# EAGLE design csa_ramdisk-v2.0f (EAGLE 4.15)
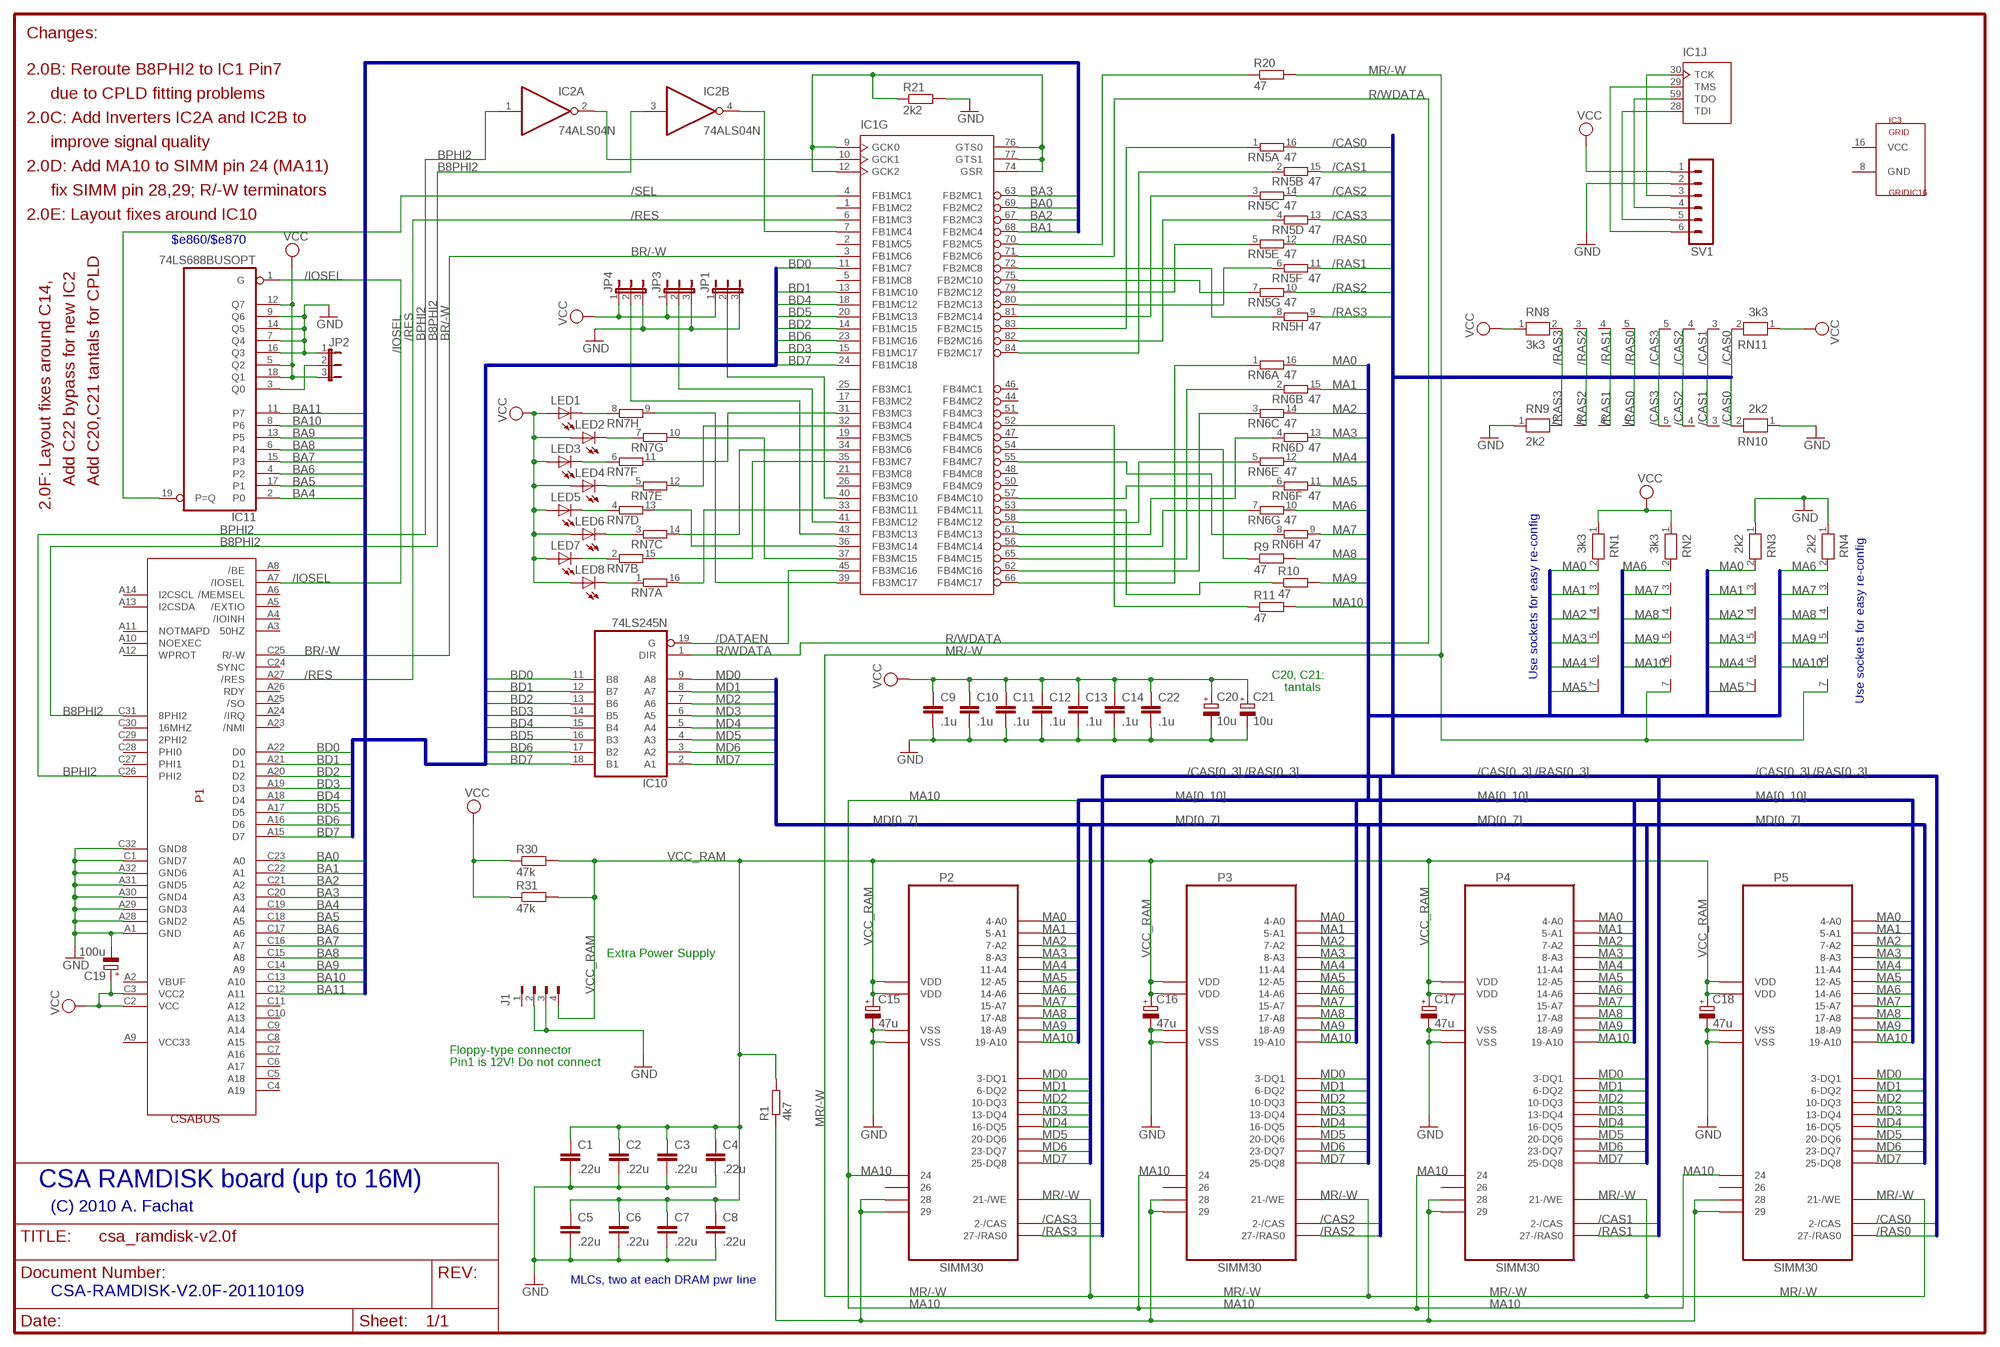
[diagram p0: schematic, sheet 1]

## Parts
C1  .22u  C-EU050-025X075  [C050-025X075]
C2  .22u  C-EU050-025X075  [C050-025X075]
C3  .22u  C-EU050-025X075  [C050-025X075]
C4  .22u  C-EU050-025X075  [C050-025X075]
C5  .22u  C-EU050-025X075  [C050-025X075]
C6  .22u  C-EU050-025X075  [C050-025X075]
C7  .22u  C-EU050-025X075  [C050-025X075]
C8  .22u  C-EU050-025X075  [C050-025X075]
C9  .1u  C-EU050-025X075  [C050-025X075]
C10  .1u  C-EU050-025X075  [C050-025X075]
C11  .1u  C-EU025-025X050  [C025-025X050]
C12  .1u  C-EU050-025X075  [C050-025X075]
C13  .1u  C-EU050-025X075  [C050-025X075]
C14  .1u  C-EU050-025X075  [C050-025X075]
C15  47u  CPOL-EUE2-5  [E2-5]
C16  47u  CPOL-EUE2-5  [E2-5]
C17  47u  CPOL-EUE2-5  [E2-5]
C18  47u  CPOL-EUE2-5  [E2-5]
C19  100u  CPOL-EUE2-5  [E2-5]
C20  10u  CPOL-EUE2.5-7  [E2,5-7]
C21  10u  CPOL-EUE2.5-7  [E2,5-7]
C22  .1u  C-EU050-025X075  [C050-025X075]
IC1  XC9572PC84  [PLCC-S84]
IC2  74ALS04N  [DIL14]
IC3  GRIDIC16  [GRIDIC8]
IC10  74LS245N  [DIL20]
IC11  74LS688BUSOPT  [DIL20]
J1  FLOP-4W827001  [827001]
JP1  JP2E  [JP2]
JP2  JP2E  [JP2]
JP3  JP2E  [JP2]
JP4  JP2E  [JP2]
LED1  LED3MM  [LED3MM]
LED2  LED3MM  [LED3MM]
LED3  LED3MM  [LED3MM]
LED4  LED3MM  [LED3MM]
LED5  LED3MM  [LED3MM]
LED6  LED3MM  [LED3MM]
LED7  LED3MM  [LED3MM]
LED8  LED3MM  [LED3MM]
P1  CSABUS  [CSABUS]
P2  SIMM30  [SIMM30]
P3  SIMM30  [SIMM30]
P4  SIMM30  [SIMM30]
P5  SIMM30  [SIMM30]
R1  4k7  R-EU_0207/10  [0207/10]
R9  47  R-EU_0204/5  [0204/5]
R10  47  R-EU_0204/5  [0204/5]
R11  47  R-EU_0204/5  [0204/5]
R20  47  R-EU_0204/5  [0204/5]
R21  2k2  R-EU_0204/5  [0204/5]
R30  47k  R-EU_0207/10  [0207/10]
R31  47k  R-EU_0207/10  [0207/10]
RN1  3k3  RN06  [RN-7]
RN2  3k3  RN06  [RN-7]
RN3  2k2  RN06  [RN-7]
RN4  2k2  RN06  [RN-7]
RN5  47  8R-N  [DIL16]
RN6  47  8R-N  [DIL16]
RN7  8R-N  [DIL16]
RN8  3k3  RN04  [RN-5]
RN9  2k2  RN04  [RN-5]
RN10  2k2  RN04  [RN-5]
RN11  3k3  RN04  [RN-5]
SV1  MA06-1  [MA06-1]

## Nets
/CAS0: P5.2(2-/CAS) RN5.16 RN10.2 RN11.2
/CAS1: P4.2(2-/CAS) RN5.15 RN10.3 RN11.3
/CAS2: P3.2(2-/CAS) RN5.14 RN10.4 RN11.4
/CAS3: P2.2(2-/CAS) RN5.13 RN10.5 RN11.5
/DATAEN: IC1.45(G:FB3MC16) IC10.19(G)
/IOSEL: IC11.1(G) P1.A7(/IOSEL)
/RAS0: P5.27(27-/RAS0) RN5.12 RN8.5 RN9.5
/RAS1: P4.27(27-/RAS0) RN5.11 RN8.4 RN9.4
/RAS2: P3.27(27-/RAS0) RN5.10 RN8.3 RN9.3
/RAS3: P2.27(27-/RAS0) RN5.9 RN8.2 RN9.2
/RES: IC1.6(G:FB1MC3) P1.A27(/RES)
/SEL: IC1.4(G:FB1MC1) IC11.19(P=Q)
B8PHI2: IC2.3(B:I) P1.C31(8PHI2)
BA0: IC1.69(G:FB2MC2) P1.C23(A0)
BA1: IC1.68(G:FB2MC4) P1.C22(A1)
BA2: IC1.67(G:FB2MC3) P1.C21(A2)
BA3: IC1.63(G:FB2MC1) P1.C20(A3)
BA4: IC11.2(P0) P1.C19(A4)
BA5: IC11.17(P1) P1.C18(A5)
BA6: IC11.4(P2) P1.C17(A6)
BA7: IC11.15(P3) P1.C16(A7)
BA8: IC11.6(P4) P1.C15(A8)
BA9: IC11.13(P5) P1.C14(A9)
BA10: IC11.8(P6) P1.C13(A10)
BA11: IC11.11(P7) P1.C12(A11)
BD0: IC1.11(G:FB1MC7) IC10.11(B8) P1.A22(D0)
BD1: IC1.13(G:FB1MC10) IC10.12(B7) P1.A21(D1)
BD2: IC1.14(G:FB1MC15) IC10.13(B6) P1.A20(D2)
BD3: IC1.15(G:FB1MC17) IC10.14(B5) P1.A19(D3)
BD4: IC1.18(G:FB1MC12) IC10.15(B4) P1.A18(D4)
BD5: IC1.20(G:FB1MC13) IC10.16(B3) P1.A17(D5)
BD6: IC1.23(G:FB1MC16) IC10.17(B2) P1.A16(D6)
BD7: IC1.24(G:FB1MC18) IC10.18(B1) P1.A15(D7)
BPHI2: IC2.1(A:I) P1.C26(PHI2)
BR/-W: IC1.3(G:FB1MC6) P1.C25(R/-W)
GND: C1.2 C2.2 C3.2 C4.2 C5.2 C6.2 C7.2 C8.2 C9.2 C10.2 C11.2 C12.2 C13.2 C14.2 C15.- C16.- C17.- C18.- C19.- C20.- C21.- C22.2 IC11.7(Q4) IC11.9(Q6) IC11.14(Q5) IC11.16(Q3) J1.2 J1.3 JP1.3 JP2.1 JP3.3 JP4.3 P1.A1(GND) P1.A28(GND2) P1.A29(GND3) P1.A30(GND4) P1.A31(GND5) P1.A32(GND6) P1.C1(GND7) P1.C32(GND8) P2.9(VSS) P2.22(VSS) P3.9(VSS) P3.22(VSS) P4.9(VSS) P4.22(VSS) P5.9(VSS) P5.22(VSS) R21.2 RN3.1 RN4.1 RN9.1 RN10.1 SV1.2
MA0: P2.4(4-A0) P3.4(4-A0) P4.4(4-A0) P5.4(4-A0) RN1.2 RN3.2 RN6.16
MA1: P2.5(5-A1) P3.5(5-A1) P4.5(5-A1) P5.5(5-A1) RN1.3 RN3.3 RN6.15
MA2: P2.7(7-A2) P3.7(7-A2) P4.7(7-A2) P5.7(7-A2) RN1.4 RN3.4 RN6.14
MA3: P2.8(8-A3) P3.8(8-A3) P4.8(8-A3) P5.8(8-A3) RN1.5 RN3.5 RN6.13
MA4: P2.11(11-A4) P3.11(11-A4) P4.11(11-A4) P5.11(11-A4) RN1.6 RN3.6 RN6.12
MA5: P2.12(12-A5) P3.12(12-A5) P4.12(12-A5) P5.12(12-A5) RN1.7 RN3.7 RN6.11
MA6: P2.14(14-A6) P3.14(14-A6) P4.14(14-A6) P5.14(14-A6) RN2.2 RN4.2 RN6.10
MA7: P2.15(15-A7) P3.15(15-A7) P4.15(15-A7) P5.15(15-A7) RN2.3 RN4.3 RN6.9
MA8: P2.17(17-A8) P3.17(17-A8) P4.17(17-A8) P5.17(17-A8) R9.2 RN2.4 RN4.4
MA9: P2.18(18-A9) P3.18(18-A9) P4.18(18-A9) P5.18(18-A9) R10.2 RN2.5 RN4.5
MA10: P2.19(19-A10) P2.24 P3.19(19-A10) P3.24 P4.19(19-A10) P4.24 P5.19(19-A10) P5.24 R11.2 RN2.6 RN4.6
MD0: IC10.9(A8) P2.3(3-DQ1) P3.3(3-DQ1) P4.3(3-DQ1) P5.3(3-DQ1)
MD1: IC10.8(A7) P2.6(6-DQ2) P3.6(6-DQ2) P4.6(6-DQ2) P5.6(6-DQ2)
MD2: IC10.7(A6) P2.10(10-DQ3) P3.10(10-DQ3) P4.10(10-DQ3) P5.10(10-DQ3)
MD3: IC10.6(A5) P2.13(13-DQ4) P3.13(13-DQ4) P4.13(13-DQ4) P5.13(13-DQ4)
MD4: IC10.5(A4) P2.16(16-DQ5) P3.16(16-DQ5) P4.16(16-DQ5) P5.16(16-DQ5)
MD5: IC10.4(A3) P2.20(20-DQ6) P3.20(20-DQ6) P4.20(20-DQ6) P5.20(20-DQ6)
MD6: IC10.3(A2) P2.23(23-DQ7) P3.23(23-DQ7) P4.23(23-DQ7) P5.23(23-DQ7)
MD7: IC10.2(A1) P2.25(25-DQ8) P3.25(25-DQ8) P4.25(25-DQ8) P5.25(25-DQ8)
MR/-W: P2.21(21-/WE) P3.21(21-/WE) P4.21(21-/WE) P5.21(21-/WE) R20.2 RN2.7 RN4.7
N$1: IC1.79(G:FB2MC12) RN5.5
N$2: IC1.70(G:FB2MC5) R20.1
N$3: IC1.40(G:FB3MC10) JP1.2
N$4: IC1.41(G:FB3MC12) JP3.2
N$5: IC11.3(Q0) JP2.2
N$6: IC1.55(G:FB4MC7) RN6.8
N$7: IC1.56(G:FB4MC14) RN6.7
N$8: IC1.57(G:FB4MC10) RN6.6
N$9: IC1.58(G:FB4MC12) RN6.5
N$10: IC1.61(G:FB4MC13) RN6.4
N$11: IC1.62(G:FB4MC16) RN6.3
N$12: IC1.65(G:FB4MC15) RN6.2
N$13: IC1.66(G:FB4MC17) RN6.1
N$14: IC1.54(G:FB4MC6) R9.1
N$15: IC1.53(G:FB4MC11) R10.1
N$16: IC1.52(G:FB4MC4) R11.1
N$17: LED1.K(C) RN7.8
N$18: IC1.80(G:FB2MC13) RN5.6
N$19: IC1.75(G:FB2MC10) RN5.7
N$20: IC1.72(G:FB2MC8) RN5.8
N$21: IC1.82(G:FB2MC16) RN5.4
N$22: IC1.81(G:FB2MC14) RN5.3
N$23: IC1.84(G:FB2MC17) RN5.2
N$24: IC1.83(G:FB2MC15) RN5.1
N$25: IC1.43(G:FB3MC13) JP4.2
N$26: IC1.10(G:GCK1) IC2.2(A:O)
N$27: IC1.7(G:FB1MC4) IC2.4(B:O)
N$28: LED2.K(C) RN7.7
N$29: IC1.9(G:GCK0) IC1.12(G:GCK2) IC1.74(G:GSR) IC1.76(G:GTS0) IC1.77(G:GTS1) R21.1
N$30: LED3.K(C) RN7.6
N$31: LED4.K(C) RN7.5
N$32: LED5.K(C) RN7.4
N$33: LED6.K(C) RN7.3
N$34: LED7.K(C) RN7.2
N$35: LED8.K(C) RN7.1
N$36: IC1.37(G:FB3MC15) RN7.10
N$37: P2.28 P2.29 P3.28 P3.29 P4.28 P4.29 P5.28 P5.29 R1.1
N$38: IC1.31(G:FB3MC3) RN7.11
N$39: IC1.32(G:FB3MC4) RN7.12
N$40: IC1.39(G:FB3MC17) RN7.9
N$41: IC1.34(G:FB3MC6) RN7.14
N$42: IC1.35(G:FB3MC7) RN7.15
N$43: IC1.33(G:FB3MC11) RN7.16
N$45: IC1.36(G:FB3MC14) RN7.13
R/WDATA: IC1.71(G:FB2MC6) IC10.1(DIR)
TCK: IC1.30(J:TCK) SV1.3
TDI: IC1.28(J:TDI) SV1.5
TDO: IC1.59(J:TDO) SV1.4
TMS: IC1.29(J:TMS) SV1.6
VCC: C9.1 C10.1 C11.1 C12.1 C13.1 C14.1 C19.+ C20.+ C21.+ C22.1 IC11.5(Q2) IC11.12(Q7) IC11.18(Q1) JP1.1 JP2.3 JP3.1 JP4.1 LED1.A LED2.A LED3.A LED4.A LED5.A LED6.A LED7.A LED8.A P1.C2(VCC) P1.C3(VCC2) R30.1 R31.1 RN1.1 RN2.1 RN8.1 RN11.1 SV1.1
VCC_RAM: C1.1 C2.1 C3.1 C4.1 C5.1 C6.1 C7.1 C8.1 C15.+ C16.+ C17.+ C18.+ J1.4 P2.1(VDD) P2.30(VDD) P3.1(VDD) P3.30(VDD) P4.1(VDD) P4.30(VDD) P5.1(VDD) P5.30(VDD) R1.2 R30.2 R31.2
Unconnected: IC1.1(G:FB1MC2) IC1.2(G:FB1MC5) IC1.5(G:FB1MC8) IC1.17(G:FB3MC2) IC1.19(G:FB3MC5) IC1.21(G:FB3MC8) IC1.25(G:FB3MC1) IC1.26(G:FB3MC9) IC1.44(G:FB4MC2) IC1.46(G:FB4MC1) IC1.47(G:FB4MC5) IC1.48(G:FB4MC8) IC1.50(G:FB4MC9) IC1.51(G:FB4MC3) IC2.5(C:I) IC2.6(C:O) IC2.8(D:O) IC2.9(D:I) IC2.10(E:O) IC2.11(E:I) IC2.12(F:O) IC2.13(F:I) J1.1 P1.A2(VBUF) P1.A3(50HZ) P1.A4(/IOINH) P1.A5(/EXTIO) P1.A6(/MEMSEL) P1.A8(/BE) P1.A9(VCC33) P1.A10(NOEXEC) P1.A11(NOTMAPD) P1.A12(WPROT) P1.A13(I2CSDA) P1.A14(I2CSCL) P1.A23(/NMI) P1.A24(/IRQ) P1.A25(/SO) P1.A26(RDY) P1.C4(A19) P1.C5(A18) P1.C6(A17) P1.C7(A16) P1.C8(A15) P1.C9(A14) P1.C10(A13) P1.C11(A12) P1.C24(SYNC) P1.C27(PHI1) P1.C28(PHI0) P1.C29(2PHI2) P1.C30(16MHZ) P2.26 P3.26 P4.26 P5.26

## Buses
BA[0..19]
BD[0..7]
MD[0..7]
MA[0..10]
/CAS[0..3],/RAS[0..3]

## Notes on the sheet
- Changes:
- 2.0B: Reroute B8PHI2 to IC1 Pin7
- due to CPLD fitting problems
- 2.0C: Add Inverters IC2A and IC2B to
- improve signal quality
- 2.0D: Add MA10 to SIMM pin 24 (MA11)
- fix SIMM pin 28,29; R/-W terminators
- 2.0E: Layout fixes around IC10
- $e860/$e870
- Add C22 bypass for new IC2 | Add C20,C21 tantals for CPLD
- 2.0F: Layout fixes around C14,
- C20, C21: | Use sockets for easy re-config
- tantals
- Use sockets for easy re-config
- Extra Power Supply
- Floppy-type connector
- Pin1 is 12V! Do not connect
- CSA RAMDISK board (up to 16M)
- (C) 2010 A. Fachat
- MLCs, two at each DRAM pwr line
- CSA-RAMDISK-V2.0F-20110109

## Power pins joined to a net without a drawn wire
GND: IC1.8(P:GND) IC1.16(P:GND) IC1.27(P:GND) IC1.42(P:GND) IC1.49(P:GND) IC1.60(P:GND) IC2.7(P:GND) IC3.8(GND) IC10.10(GND) IC11.10(GND)
VCC: IC1.22(P:VCC) IC1.38(P:VCC) IC1.64(P:VCC) IC1.73(P:VCC) IC1.78(P:VCC) IC2.14(P:VCC) IC3.16(VCC) IC10.20(VCC) IC11.20(VCC)

## Library data of the parts
C1-C14 C22 = rcl:C-EU: CAPACITOR, European symbol
C15-C21 = rcl:CPOL-EU: POLARIZED CAPACITOR, European symbol
IC1 = XILINX:XC9572PC84
IC2 = 74xx-eu:74*04: Hex INVERTER
IC3 = csa:GRIDIC
IC10 = 74xx-us:74*245: Octal BUS TRANSCEIVER, 3-state
IC11 = csa:74LS688BUSOPT
J1 = con-amp:FLOP-4W: MATE N-LOCK Floppy / HDD conector Distributor: Bürklin 71F972
JP1-JP4 = jumper:JP2E: JUMPER
LED1-LED8 = led:LED: LED OSRAM: - CHIPLED LG R971, LG N971, LY N971, LG Q971, LY Q971, LO R971, LY R971 LH N974, LH R974 LS Q976, LO Q976, LY Q976 LO Q996 - Hyper CHIPLED LW Q18S LB Q993, LB Q99A, LB R99A - SideLED LS A670, LO A670, LY A670, LG A670, LP A670 LB A673, LV A673, LT A673, LW A673 LH A674 LY A675 LS A676, LA A676, LO A676, LY A676, LW A676 LS A679, LY A679, LG A679 - Hyper Micro SIDELED® LS Y876, LA Y876, LO Y876, LY Y876 LT Y87S - SmartLED LW L88C, LW L88S LB L89C, LB L89S, LG L890 LS L89K, LO L89K, LY L89K LS L896, LA L896, LO L896, LY L896 - TOPLED LS T670, LO T670, LY T670, LG T670, LP T670 LSG T670, LSP T670, LSY T670, LOP T670, LYG T670 LG T671, LOG T671, LSG T671 LB T673, LV T673, LT T673, LW T673 LH T674 LS T676, LA T676, LO T676, LY T676, LB T676, LH T676, LSB T676, LW T676 LB T67C, LV T67C, LT T67C, LS T67K, LO T67K, LY T67K, LW E67C LS E67B, LA E67B, LO E67B, LY E67B, LB E67C, LV E67C, LT E67C LW T67C LS T679, LY T679, LG T679 LS T770, LO T770, LY T770, LG T770, LP T770 LB T773, LV T773, LT T773, LW T773 LH T774 LS E675, LA E675, LY E675, LS T675 LS T776, LA T776, LO T776, LY T776, LB T776 LHGB T686 LT T68C, LB T68C - Hyper Mini TOPLED® LB M676 - Mini TOPLED Santana® LG M470 LS M47K, LO M47K, LY M47K Source: http://www.osram.convergy.de/
P1 = csa:CSABUS
P2-P5 = csa:SIMM30
R1 R9-R11 R20 R21 R30 R31 = rcl:R-EU_: RESISTOR, European symbol
RN1-RN4 = resistor-net:RN06: RESISTOR NETWORK
RN5-RN7 = resistor-dil:8R-N: DIL RESISTOR
RN8-RN11 = resistor-net:RN04: RESISTOR NETWORK
SV1 = con-lstb:MA06-1: PIN HEADER

## Board
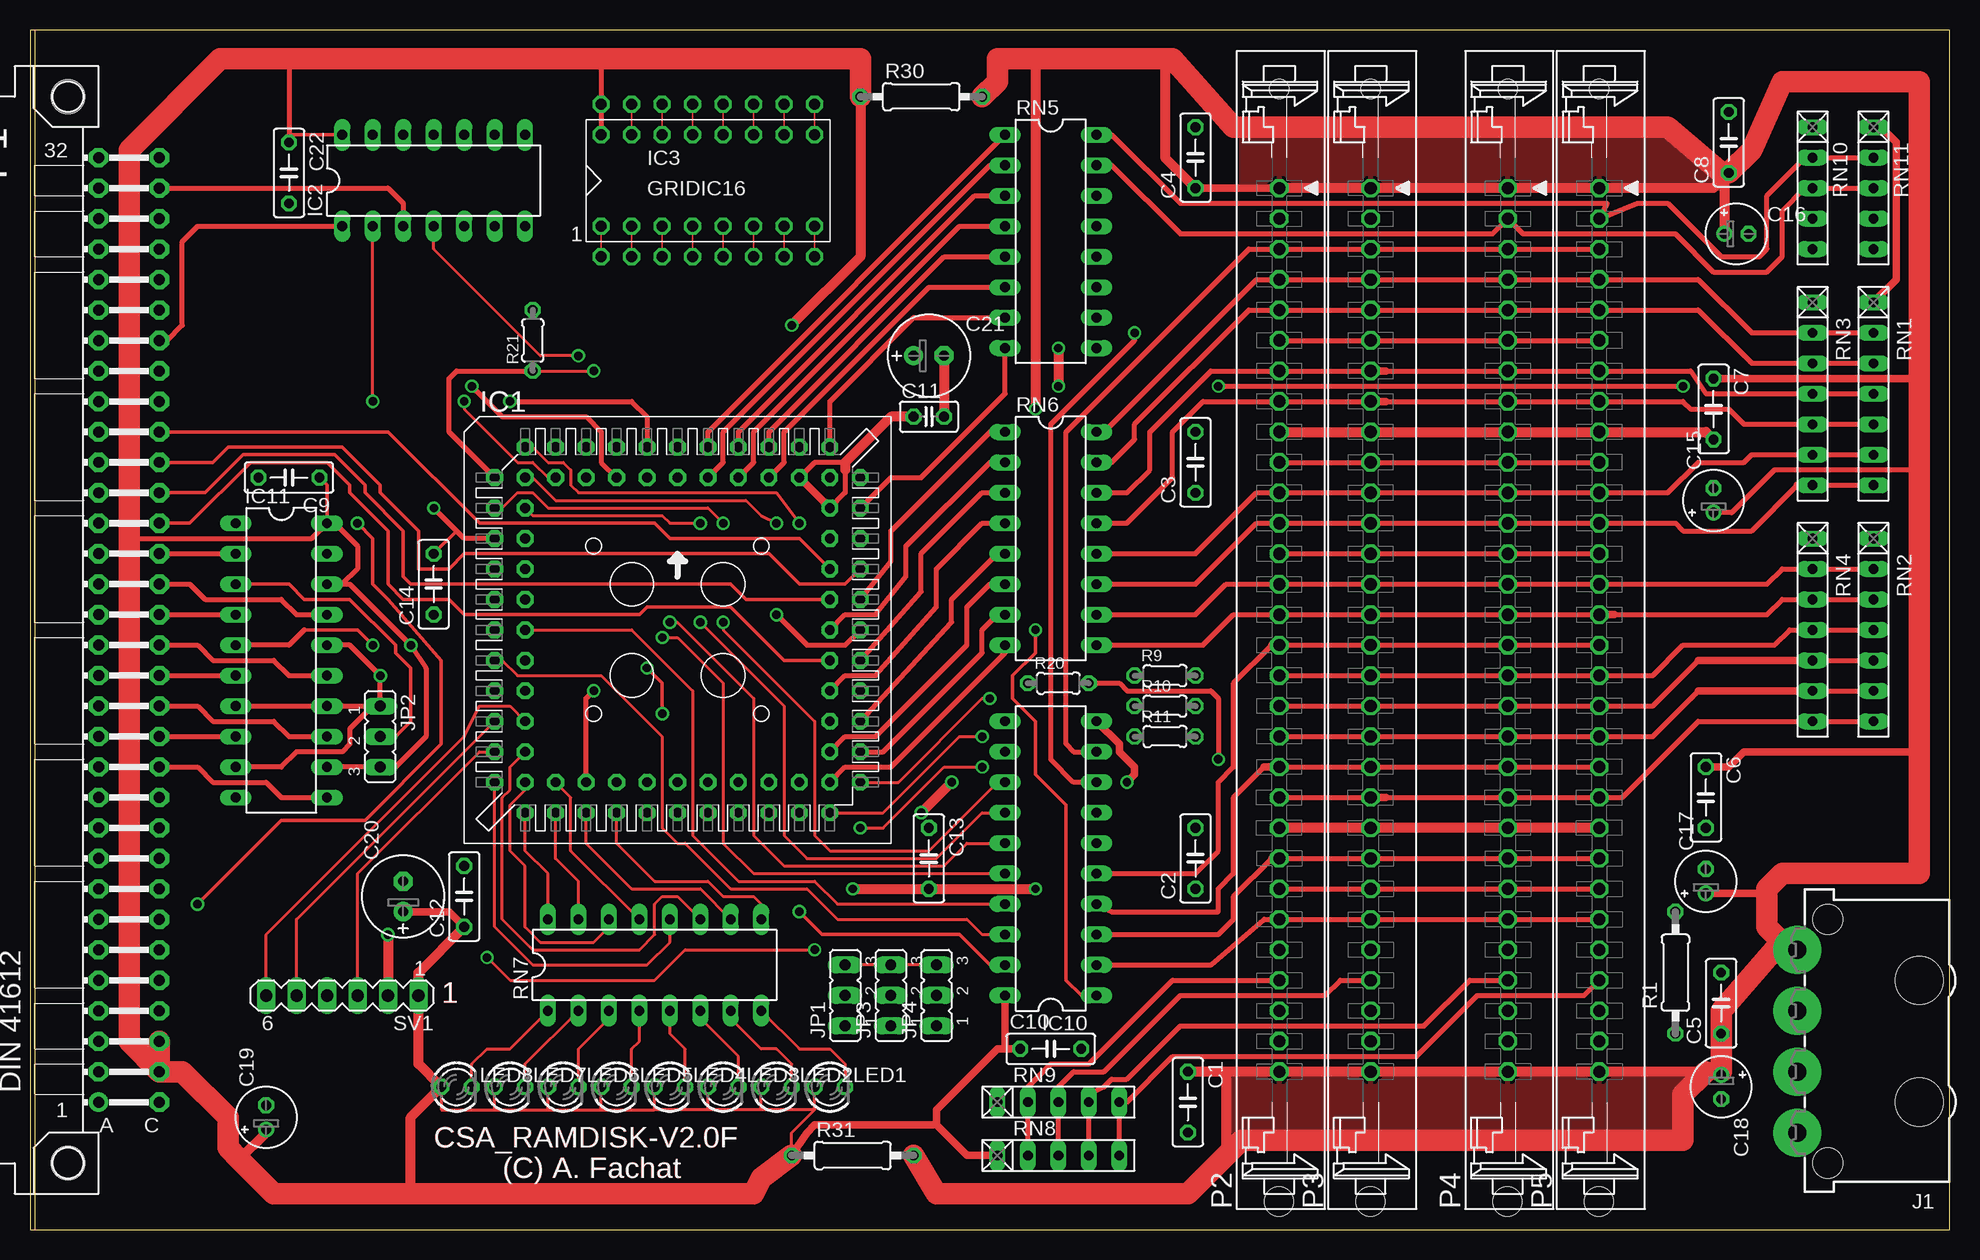
[diagram p1: board, top side]
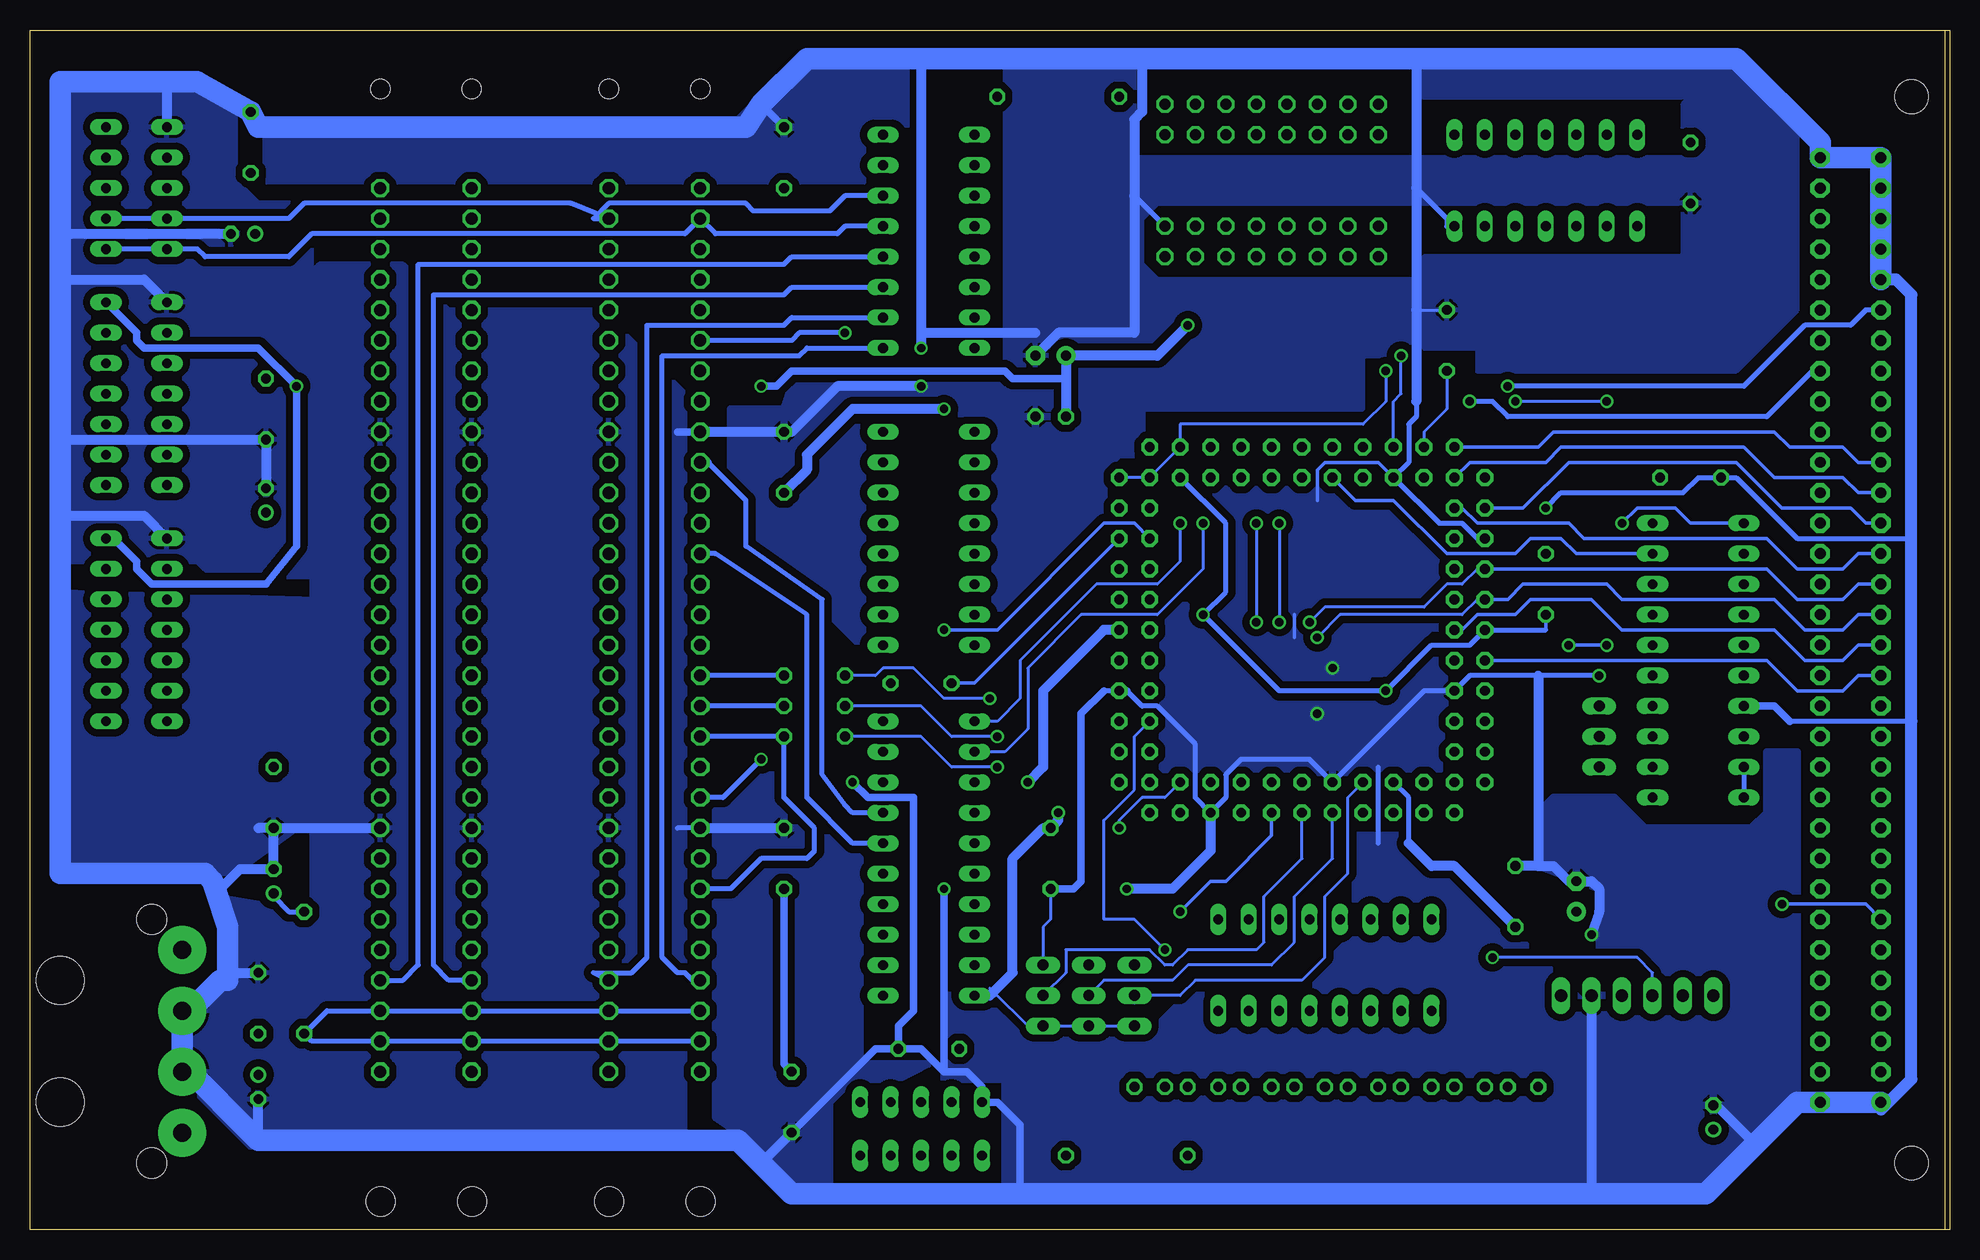
[diagram p2: board, bottom side, seen from below]

Size 160 x 100.03 mm. Coordinates in mm from the lower left corner, seen from the top.
Outline: 0,0.01 160,0.01 160,100.01 0,100.01 0,0.01
Copper layers (1*16): Top 0.035mm / dielectric 1.5mm / Bottom 0.035mm
Design rules "default": minimum track width 10mil, minimum drill 24mil, track to track 8mil, track to pad 8mil, pad to pad 8mil, via to via 8mil, smd to smd 8mil, copper to edge 40mil, drill to drill 8mil, minimum pad ring 10mil, minimum via ring 8mil, stop-mask expansion 4mil, vias tented up to drill 0mil, thermal gap 10mil

### Footprints (pad centres in the part's own frame; a part is rotated, then mirrored left to right if it is on the bottom)
C050-025X075 = drill 0.813 octagon: 1 -2.54,0; 2 2.54,0
C025-025X050 = drill 0.813 octagon: 1 -1.27,0; 2 1.27,0
E2-5 = drill 0.813 pad 1.27 round: + -1.016,0 | drill 0.813 pad 1.27 octagon: - 1.016,0
E2,5-7 = drill 0.813 pad 1.6 round: + -1.27,0 | drill 0.813 pad 1.6 octagon: - 1.27,0
PLCC-S84 = drill 0.813 pad 1.397 octagon: 1 0,15.24; 2 0,12.7; 3 -2.54,15.24; 4 -2.54,12.7; 5 -5.08,15.24; 6 -5.08,12.7; 7 -7.62,15.24; 8 -7.62,12.7; 9 -10.16,15.24; 10 -10.16,12.7; 11 -12.7,15.24; 12 -15.24,12.7; 13 -12.7,12.7; 14 -15.24,10.16; 15 -12.7,10.16; 16 -15.24,7.62; 17 -12.7,7.62; 18 -15.24,5.08; 19 -12.7,5.08; 20 -15.24,2.54; 21 -12.7,2.54; 22 -15.24,0; 23 -12.7,0; 24 -15.24,-2.54; 25 -12.7,-2.54; 26 -15.24,-5.08; 27 -12.7,-5.08; 28 -15.24,-7.62; 29 -12.7,-7.62; 30 -15.24,-10.16; 31 -12.7,-10.16; 32 -15.24,-12.7; 33 -12.7,-15.24; 34 -12.7,-12.7; 35 -10.16,-15.24; 36 -10.16,-12.7; 37 -7.62,-15.24; 38 -7.62,-12.7; 39 -5.08,-15.24; 40 -5.08,-12.7; 41 -2.54,-15.24; 42 -2.54,-12.7; 43 0,-15.24; 44 0,-12.7; 45 2.54,-15.24; 46 2.54,-12.7; 47 5.08,-15.24; 48 5.08,-12.7; 49 7.62,-15.24; 50 7.62,-12.7; 51 10.16,-15.24; 52 10.16,-12.7; 53 12.7,-15.24; 54 15.24,-12.7; 55 12.7,-12.7; 56 15.24,-10.16; 57 12.7,-10.16; 58 15.24,-7.62; 59 12.7,-7.62; 60 15.24,-5.08; 61 12.7,-5.08; 62 15.24,-2.54; 63 12.7,-2.54; 64 15.24,0; 65 12.7,0; 66 15.24,2.54; 67 12.7,2.54; 68 15.24,5.08; 69 12.7,5.08; 70 15.24,7.62; 71 12.7,7.62; 72 15.24,10.16; 73 12.7,10.16; 74 15.24,12.7; 75 12.7,15.24; 76 12.7,12.7; 77 10.16,15.24; 78 10.16,12.7; 79 7.62,15.24; 80 7.62,12.7; 81 5.08,15.24; 82 5.08,12.7; 83 2.54,15.24; 84 2.54,12.7
DIL14 = drill 0.813 long: 1 -7.62,-3.81; 2 -5.08,-3.81; 3 -2.54,-3.81; 4 0,-3.81; 5 2.54,-3.81; 6 5.08,-3.81; 7 7.62,-3.81; 8 7.62,3.81; 9 5.08,3.81; 10 2.54,3.81; 11 0,3.81; 12 -2.54,3.81; 13 -5.08,3.81; 14 -7.62,3.81
GRIDIC8 = drill 0.914 octagon: 1 -8.89,-3.81; 2 -6.35,-3.81; 3 -3.81,-3.81; 4 -1.27,-3.81; 5 1.27,-3.81; 6 3.81,-3.81; 7 6.35,-3.81; 8 8.89,-3.81; 9 8.89,3.81; 10 6.35,3.81; 11 3.81,3.81; 12 1.27,3.81; 13 -1.27,3.81; 14 -3.81,3.81; 15 -6.35,3.81; 16 -8.89,3.81; X1 -8.89,-6.35; X2 -6.35,-6.35; X3 -3.81,-6.35; X4 -1.27,-6.35; X5 1.27,-6.35; X6 3.81,-6.35; X7 6.35,-6.35; X8 8.89,-6.35; X9 8.89,6.35; X10 6.35,6.35; X11 3.81,6.35; X12 1.27,6.35; X13 -1.27,6.35; X14 -3.81,6.35; X15 -6.35,6.35; X16 -8.89,6.35
DIL20 = drill 0.813 long: 1 -11.43,-3.81; 2 -8.89,-3.81; 3 -6.35,-3.81; 4 -3.81,-3.81; 5 -1.27,-3.81; 6 1.27,-3.81; 7 3.81,-3.81; 8 6.35,-3.81; 9 8.89,-3.81; 10 11.43,-3.81; 11 11.43,3.81; 12 8.89,3.81; 13 6.35,3.81; 14 3.81,3.81; 15 1.27,3.81; 16 -1.27,3.81; 17 -3.81,3.81; 18 -6.35,3.81; 19 -8.89,3.81; 20 -11.43,3.81
DIL20' = drill 0.813 long: 1 -10.16,-3.81; 2 -7.62,-3.81; 3 -5.08,-3.81; 4 -2.54,-3.81; 5 0,-3.81; 6 2.54,-3.81; 7 5.08,-3.81; 8 7.62,-3.81; 9 10.16,-3.81; 10 12.7,-3.81; 11 12.7,3.81; 12 10.16,3.81; 13 7.62,3.81; 14 5.08,3.81; 15 2.54,3.81; 16 0,3.81; 17 -2.54,3.81; 18 -5.08,3.81; 19 -7.62,3.81; 20 -10.16,3.81
827001 = drill 1.5 pad 4 round: 1 -7.62,0; 2 -2.54,0; 3 2.54,0; 4 7.62,0 | hole 4: 5.08,-10.16; -5.08,-10.16 | hole 2.5: 10.16,-2.54; -10.16,-2.54
JP2 = drill 0.914 long: 1 -2.54,0; 2 0,0; 3 2.54,0
LED3MM = drill 0.813 octagon: A -1.27,0; K 1.27,0
CSABUS = drill 0.914 pad 1.6 round: A1 7.62,36.83 | drill 0.914 pad 1.6 octagon: A2 7.62,34.29; A3 7.62,31.75; A4 7.62,29.21; A5 7.62,26.67; A6 7.62,24.13; A7 7.62,21.59; A8 7.62,19.05; A9 7.62,16.51; A10 7.62,13.97; A11 7.62,11.43; A12 7.62,8.89; A13 7.62,6.35; A14 7.62,3.81; A15 7.62,1.27; A16 7.62,-1.27; A17 7.62,-3.81; A18 7.62,-6.35; A19 7.62,-8.89; A20 7.62,-11.43; A21 7.62,-13.97; A22 7.62,-16.51; A23 7.62,-19.05; A24 7.62,-21.59; A25 7.62,-24.13; A26 7.62,-26.67; A27 7.62,-29.21; A28 7.62,-31.75; A29 7.62,-34.29; A30 7.62,-36.83; A31 7.62,-39.37; A32 7.62,-41.91; C1 2.54,36.83; C2 2.54,34.29; C3 2.54,31.75; C4 2.54,29.21; C5 2.54,26.67; C6 2.54,24.13; C7 2.54,21.59; C8 2.54,19.05; C9 2.54,16.51; C10 2.54,13.97; C11 2.54,11.43; C12 2.54,8.89; C13 2.54,6.35; C14 2.54,3.81; C15 2.54,1.27; C16 2.54,-1.27; C17 2.54,-3.81; C18 2.54,-6.35; C19 2.54,-8.89; C20 2.54,-11.43; C21 2.54,-13.97; C22 2.54,-16.51; C23 2.54,-19.05; C24 2.54,-21.59; C25 2.54,-24.13; C26 2.54,-26.67; C27 2.54,-29.21; C28 2.54,-31.75; C29 2.54,-34.29; C30 2.54,-36.83; C31 2.54,-39.37; C32 2.54,-41.91 | hole 2.794: 10.16,41.91; 10.16,-46.99
SIMM30 = drill 1.016 octagon: 1 50.8,1.27; 2 48.26,1.27; 3 45.72,1.27; 4 43.18,1.27; 5 40.64,1.27; 6 38.1,1.27; 7 35.56,1.27; 8 33.02,1.27; 9 30.48,1.27; 10 27.94,1.27; 11 25.4,1.27; 12 22.86,1.27; 13 20.32,1.27; 14 17.78,1.27; 15 15.24,1.27; 16 12.7,1.27; 17 10.16,1.27; 18 7.62,1.27; 19 5.08,1.27; 20 2.54,1.27; 21 0,1.27; 22 -2.54,1.27; 23 -5.08,1.27; 24 -7.62,1.27; 25 -10.16,1.27; 26 -12.7,1.27; 27 -15.24,1.27; 28 -17.78,1.27; 29 -20.32,1.27; 30 -22.86,1.27 | hole 2.413: -33.68,1.295 | hole 1.6: 59.055,1.27
0207/10 = drill 0.813 octagon: 1 -5.08,0; 2 5.08,0
0204/5 = drill 0.813 octagon: 1 -2.54,0; 2 2.54,0
RN-7 = drill 0.813 long: 1 -7.62,0; 2 -5.08,0; 3 -2.54,0; 4 0,0; 5 2.54,0; 6 5.08,0; 7 7.62,0
DIL16 = drill 0.813 long: 1 -8.89,-3.81; 2 -6.35,-3.81; 3 -3.81,-3.81; 4 -1.27,-3.81; 5 1.27,-3.81; 6 3.81,-3.81; 7 6.35,-3.81; 8 8.89,-3.81; 9 8.89,3.81; 10 6.35,3.81; 11 3.81,3.81; 12 1.27,3.81; 13 -1.27,3.81; 14 -3.81,3.81; 15 -6.35,3.81; 16 -8.89,3.81
RN-5 = drill 0.813 long: 1 -5.08,0; 2 -2.54,0; 3 0,0; 4 2.54,0; 5 5.08,0
MA06-1 = drill 1.016 long: 1 -6.35,0; 2 -3.81,0; 3 -1.27,0; 4 1.27,0; 5 3.81,0; 6 6.35,0

### Placement (x,y rotation side)
C1  96.52,10.64 270 top
C2  97.15,30.96 90 top
C3  97.15,63.98 90 top
C4  97.15,89.38 90 top
C5  140.97,18.9 90 top
C6  139.69,36.04 270 top
C7  140.33,68.43 270 top
C8  141.6,90.65 90 top
C9  21.58,62.71 180 top
C10  85.08,15.09 0 top
C11  74.92,67.79 0 top
C12  36.19,27.79 90 top
C13  74.92,30.96 270 top
C14  33.65,53.82 90 top
C15  140.33,60.81 90 top
C16  142.23,83.03 0 top
C17  139.69,29.06 90 top
C18  140.97,11.91 270 top
C19  19.68,9.37 90 top
C20  31.11,27.79 90 top
C21  74.92,72.87 0 top
C22  21.58,88.11 270 top
IC1  53.97,50.01 0 top
IC2  33.65,87.48 0 top
IC3  56.51,87.48 0 top
IC10  85.08,30.96 90 top
IC11  74LS688BUSOPT  [DIL20']  20.95,48.74 270 top
J1  147.31,15.72 90 top
JP1  67.94,19.53 90 top
JP2  29.2,41.12 270 top
JP3  71.75,19.53 90 top
JP4  75.56,19.53 90 top
LED1  66.67,11.91 0 top
LED2  62.23,11.91 0 top
LED3  57.78,11.91 0 top
LED4  53.34,11.91 0 top
LED5  48.89,11.91 0 top
LED6  44.45,11.91 0 top
LED7  40,11.91 0 top
LED8  35.55,11.91 0 top
P1  13.33,47.47 180 top
P2  105.41,36.04 90 top
P3  113.02,36.04 90 top
P4  124.45,36.04 90 top
P5  132.07,36.04 90 top
R1  137.16,21.44 90 top
R9  94.61,46.2 0 top
R10  94.61,43.66 0 top
R11  94.61,41.12 0 top
R20  85.72,45.57 0 top
R21  41.91,74.14 90 top
R30  74.29,94.46 0 top
R31  68.57,6.2 0 top
RN1  153.66,69.7 270 top
RN2  153.66,50.01 270 top
RN3  148.59,69.7 270 top
RN4  148.59,50.01 270 top
RN5  85.08,82.4 270 top
RN6  85.08,57.63 270 top
RN7  52.07,22.07 0 top
RN8  85.72,6.2 0 top
RN9  85.72,10.64 0 top
RN10  148.59,86.84 270 top
RN11  153.66,86.84 270 top
SV1  26.03,19.53 180 top

### Tracks (layer width: path | path; a pad name or v marks a point on that pad's centre or on a via)
/CAS0
  Top 0.406: RN5.16 90.16,91.29 95.88,85.57 131.44,85.57 P5.2 133.98,85.57 136.52,85.57 140.97,81.13 144.14,81.13 144.78,81.76 144.78,86.21 147.95,89.38 | RN10.2 RN11.2
  Top 0.61: 147.95,89.38 RN10.2
/CAS1
  Top 0.406: RN5.15 90.16,88.75 95.88,83.03 121.91,83.03 P4.2 124.45,83.03 137.16,83.03 140.33,79.86 144.78,79.86 146.04,81.13 146.04,84.94 147.95,86.84 | RN10.3 RN11.3
  Top 0.61: 147.95,86.84 RN10.3
/CAS2
  Bottom 0.406: RN5.14 92.07,86.21 93.34,84.94 99.69,84.94 100.32,85.57 111.75,85.57 113.02,84.3 P3.2 114.93,85.57 137.16,85.57 138.42,84.3 RN10.4 RN11.4
/CAS3
  Bottom 0.406: RN5.13 92.07,83.67 92.7,83.03 102.86,83.03 P2.2 105.41,83.03 136.52,83.03 138.42,81.13 145.41,81.13 146.04,81.76 RN10.5 RN11.5
/DATAEN  (via drill 0.7)
  Top 0.305: v64.13,26.52 66.03,24.61 77.46,24.61 80,22.07 IC10.19
  Bottom 0.305: IC1.45 56.51,32.87 60.32,29.06 61.59,29.06 v64.13,26.52
/IOSEL  (via drill 0.7)
  Top 0.305: v27.3,58.9 28.57,57.63 28.57,53.82 29.84,52.55 34.29,47.47 34.29,40.49 27.93,34.14 20.95,34.14 v13.97,27.15
  Bottom 0.305: IC11.1 21.58,58.9 22.86,60.17 26.03,60.17 v27.3,58.9 | v13.97,27.15 6.98,27.15 P1.A7
/RAS0
  Top 0.406: RN8.5 RN9.5 91.44,10.64 95.24,14.45 115.56,14.45 120.64,19.53 129.53,19.53 P5.27
  Bottom 0.406: RN5.12 96.52,81.13 97.15,80.49 127.63,80.49 127.63,22.07 128.9,20.8 P5.27
/RAS1
  Top 0.406: RN8.4 RN9.4 88.26,11.28 89.53,11.91 90.16,12.55 91.44,12.55 95.88,16.99 116.2,16.99 120.01,20.8 P4.27
  Bottom 0.406: RN5.11 96.52,78.59 97.15,77.95 126.36,77.95 126.36,22.07 125.09,20.8 P4.27
  Bottom 0.61: P4.27 123.82,20.8
/RAS2
  Top 0.406: RN8.3 RN9.3 85.72,11.91 86.99,13.18 89.53,13.18 95.88,19.53 107.94,19.53 109.21,20.8 P3.27
  Bottom 0.406: RN5.10 96.52,76.05 97.15,75.41 108.58,75.41 108.58,22.71 109.85,21.44 113.02,21.44 P3.27
/RAS3
  Top 0.406: P2.27 95.24,20.8 88.26,13.82 85.08,13.82 83.18,11.91 RN9.2 RN8.2
  Bottom 0.406: RN5.9 95.24,73.51 95.88,72.87 107.31,72.87 107.31,22.71 106.04,21.44 105.41,21.44 104.77,20.8 P2.27
/RES  (via drill 0.7)
  Top 0.406: v36.83,70.33 39.37,67.79 46.35,67.79 47.62,66.52 47.62,63.98 IC1.6
  Bottom 0.406: P1.A27 6.98,76.68 8.25,75.41 12.06,75.41 17.14,70.33 v36.83,70.33
/SEL
  Bottom 0.305: IC11.19 31.11,56.36 32.38,57.63 34.92,57.63 36.19,56.36 41.91,56.36 46.35,60.81 49.53,60.81 IC1.4
B8PHI2
  Top 0.406: P1.C31 29.84,86.84 31.11,85.57 IC2.3
BA0
  Top 0.305: P1.C23 29.84,66.52 37.46,58.9 52.07,58.9 53.34,57.63 64.13,57.63 IC1.69
BA1
  Top 0.305: P1.C22 15.24,63.98 16.5,65.25 26.03,65.25 29.2,62.08 29.2,61.44 32.38,58.27 32.38,55.09 34.92,55.09 36.19,56.36 61.59,56.36 64.13,53.82 67.94,53.82 IC1.68
BA2
  Top 0.305: P1.C21 14.6,61.44 17.77,64.62 25.39,64.62 27.93,62.08 27.93,61.44 31.11,58.27 31.11,54.46 31.74,53.82 58.41,53.82 59.69,52.55 IC1.67
BA3
  Top 0.305: P1.C20 13.33,58.9 18.41,63.98 24.76,63.98 26.66,62.08 26.66,61.44 29.84,58.27 29.84,53.82 31.11,52.55 34.92,52.55 36.19,51.28 50.8,51.28 51.43,51.92 58.41,51.92 62.86,47.47 IC1.63
BA4
  Top 0.406: P1.C19 IC11.2
BA5
  Top 0.406: IC11.17 22.22,51.28 20.95,52.55 14.6,52.55 13.33,53.82 P1.C18
BA6
  Top 0.406: P1.C17 IC11.4
BA7
  Top 0.406: IC11.15 21.58,46.2 20.31,47.47 15.24,47.47 13.97,48.74 P1.C16
BA8
  Top 0.406: P1.C15 IC11.6
BA9
  Top 0.406: IC11.13 21.58,41.12 20.31,42.39 15.24,42.39 13.97,43.66 P1.C14
BA10
  Top 0.406: P1.C13 IC11.8
BA11
  Top 0.406: IC11.11 20.95,36.04 19.68,37.31 15.24,37.31 13.97,38.58 P1.C12
BD0  (via drill 0.7)
  Top 0.254: v64.13,58.9 62.23,61.44 45.72,61.44 45.08,62.08 45.08,63.35 44.45,63.98 43.18,63.98 41.91,65.25 IC1.11
  Bottom 0.254: IC10.11 79.37,42.39 77.46,44.3 77.46,47.47 71.11,53.82 66.03,53.82 64.13,55.73 v64.13,58.9
  Bottom 0.305: P1.A22 7.62,63.98 8.89,65.25 13.33,65.25 14.6,66.52 33.02,66.52 34.29,65.25 IC1.11
BD1  (via drill 0.7)
  Top 0.254: IC1.13 41.91,62.71 43.81,60.81 59.69,60.81 60.96,59.54 v62.23,58.9
  Bottom 0.254: v62.23,58.9 62.23,55.09 66.03,51.28 72.38,51.28 76.83,46.84 76.83,41.76 78.73,39.85 IC10.12
  Bottom 0.305: P1.A21 7.62,61.44 8.89,62.71 14.6,62.71 17.14,65.25 32.38,65.25 33.65,63.98 40,63.98 IC1.13
BD2  (via drill 0.7)
  Top 0.254: IC10.13 80.64,37.31 74.92,31.6 66.67,31.6 65.4,32.87 65.4,42.39 57.78,50.01 v57.78,50.65 | IC1.14 39.37,60.17 40.64,61.44 41.91,61.44 43.18,60.17 56.51,60.17 v57.78,58.9
  Bottom 0.254: v57.78,58.9 v57.78,50.65
  Bottom 0.305: P1.A20 6.98,58.9 8.25,60.17 13.97,60.17 17.77,63.98 31.74,63.98 35.55,60.17 IC1.14
BD3  (via drill 0.7)
  Top 0.254: IC10.14 79.37,34.77 75.56,30.96 64.77,30.96 62.86,32.87 62.86,43.66 v55.88,50.65 | IC1.15 41.91,59.54 52.7,59.54 53.34,58.9 v55.88,58.9
  Bottom 0.254: v55.88,58.9 v55.88,50.65
  Bottom 0.305: P1.A19 7.62,56.36 8.89,55.09 12.7,55.09 15.24,57.63 30.47,57.63 31.74,58.9 39.37,58.9 40.64,60.17 IC1.15
BD4  (via drill 0.7)
  Top 0.254: IC10.15 78.1,32.23 76.19,30.33 62.86,30.33 60.32,32.87 60.32,44.3 53.97,50.65 v53.34,50.65
  Bottom 0.254: IC1.18 39.37,55.09 40.64,53.82 41.91,53.82 43.81,51.92 52.07,51.92 v53.34,50.65
  Bottom 0.305: P1.A18 7.62,53.82 8.89,52.55 12.7,52.55 15.24,55.09 IC1.18
BD5  (via drill 0.7)
  Top 0.254: IC10.16 60.32,29.69 57.78,32.23 57.78,45.57 53.97,49.38 v52.7,49.38
  Bottom 0.254: IC1.20 39.37,52.55 40.64,51.28 50.8,51.28 v52.7,49.38
  Bottom 0.305: P1.A17 7.62,51.28 8.89,50.01 12.06,50.01 14.6,52.55 27.3,52.55 28.57,53.82 35.55,53.82 36.83,52.55 IC1.20
BD6
  Top 0.254: IC10.17 67.3,27.15 65.4,29.06 59.05,29.06 55.24,32.87 55.24,44.93 50.16,50.01 IC1.23
  Bottom 0.305: P1.A16 7.62,48.74 8.89,47.47 12.06,47.47 14.6,50.01 27.3,50.01 29.84,52.55 34.92,52.55 36.19,51.28 39.37,51.28 40.64,50.01 IC1.23
BD7
  Top 0.254: IC1.24 39.37,47.47 40.64,46.2 47.62,46.2 52.7,41.12 52.7,33.5 53.97,32.23 54.61,32.23 58.41,28.42 64.77,28.42 67.3,25.88 78.1,25.88 79.37,24.61 IC10.18
  Bottom 0.305: P1.A15 7.62,46.2 8.89,44.93 12.7,44.93 15.24,47.47 IC1.24
BPHI2
  Top 0.406: P1.C26 11.43,74.14 12.7,75.41 12.7,82.4 13.97,83.67 IC2.1
BR/-W  (via drill 0.7)
  Top 0.406: v40,69.06 50.16,69.06 51.43,67.79 IC1.3
  Bottom 0.406: P1.C25 11.43,71.6 15.24,67.79 36.83,67.79 38.1,69.06 v40,69.06
GND  (via drill 0.7)
  Top 0.254: JP1.3 JP3.3 JP4.3
  Top 0.305: v52.7,43.03 52.7,45.57 v51.43,46.84 | 35.55,58.27 C14.2
  Top 0.406: IC11.7 IC11.14 28.57,43.66 | 28.57,43.66 JP2.1 v29.2,46.2 26.66,48.74 IC11.16 | IC11.9 20.95,38.58 22.22,39.85 26.03,39.85 26.66,40.49 26.66,41.76 28.57,43.66 | v33.65,60.17 35.55,58.27 36.19,57.63 IC1.16
  Top 0.61: IC10.10 90.8,40.49 90.8,39.85 92.07,38.58 92.07,37.95 v91.44,37.31
  Top 0.813: P2.22 P3.22 P4.22 P5.22 | P2.9 P3.9 P4.9 P5.9 139.69,66.52 C7.2 | v85.72,73.51 v85.72,70.33 | v83.81,28.42 C13.2 v68.57,28.42 | v29.84,24.61 SV1.2 | C21.- C11.2
  Bottom 0.254: 44.45,76.68 R21.2 | JP4.3 75.56,25.25 74.92,25.88 C13.2
  Bottom 0.305: IC1.8 47.62,63.98 52.07,63.98 52.7,63.35 52.7,60.81 | 54.61,49.38 54.61,51.28 | 41.91,83.67 IC2.7
  Bottom 0.406: IC11.9 IC11.10 | 41.91,83.67 41.91,84.3 44.45,86.84 | 67.94,86.21 IC3.8 | 44.45,69.06 44.45,67.79 45.08,67.16 45.08,63.98 IC1.8 42.54,58.9 40.64,58.9 39.37,57.63 IC1.16 | v29.2,46.2 34.29,46.2 40,46.2 IC1.27 43.81,44.93 IC1.42 53.34,39.22 59.05,39.22 60.32,37.95 60.32,36.04 IC1.49 62.86,36.04 62.86,40.49 66.03,43.66 67.3,43.66 68.57,44.93 | v33.65,60.17 32.38,61.44 22.22,61.44 20.95,62.71 C9.2 17.77,62.71 12.7,57.63 3.17,57.63 | IC1.60 70.48,44.93 | 3.17,42.39 13.33,42.39 | P2.22 106.04,33.5 | 47.62,32.23 47.62,38.58
  Bottom 0.61: 99.05,93.83 C4.2 | C10.2 85.72,15.09 83.81,13.18 | 83.81,13.18 81.91,13.18 80.64,11.91 RN9.1 79.37,10.64 77.46,8.74 77.46,3.02 | C10.2 89.53,15.09 C1.2 | 68.57,44.93 IC1.60 | 70.48,44.93 72.38,43.03 72.38,29.06 73.02,28.42 C13.2 | IC11.7 14.6,43.66 13.33,42.39 | P2.9 106.04,66.52 | v91.44,37.31 90.16,36.04 86.35,36.04 86.35,18.26 87.62,16.99 C10.2 | v83.81,28.42 83.81,13.18
  Bottom 0.813: 44.45,97.64 44.45,86.84 44.45,76.68 44.45,69.06 | 67.3,97.64 67.3,93.19 67.94,92.56 67.94,86.21 67.94,74.78 74.29,74.78 C21.- | 140.97,7.47 C18.- | 143.5,21.44 C5.2 | 99.05,5.56 C1.2 | P2.22 C2.2 | C6.2 P5.22 | C6.2 C17.- 142.49,30.07 144.27,28.3 144.52,28.3 | C6.2 140.97,33.5 | P2.9 C3.2 96.52,66.52 92.7,70.33 v85.72,70.33 | C15.- C7.2 157.47,65.89 | RN4.1 150.49,59.54 157.47,59.54 | 157.47,83.03 C16.- | RN3.1 150.49,79.22 157.47,79.22 | 148.59,95.73 RN10.1 | 85.72,74.78 v85.72,73.51 | 85.72,97.64 85.72,74.78 | 85.72,74.78 76.19,74.78 | SV1.2 29.84,3.02 | v29.84,24.61 29.2,26.52 29.2,28.42 29.84,29.06 C20.- 31.74,29.06 33.02,30.33 34.29,30.33 | 34.29,30.33 C12.2 | 15.87,6.83 16.19,7.15 19.43,10.39 C19.- | 34.29,46.2 34.29,30.33 | v68.57,28.42 64.77,28.42 61.59,31.6 IC1.49
  Bottom 1.016: P1.A28 4.44,79.22 3.17,77.95 3.17,42.39 3.17,12.55 5.71,10.01
  Bottom 1.778: P1.A1 P1.C1 12.7,10.64 16.19,7.15 20.31,3.02 29.84,3.02 77.46,3.02 96.52,3.02 99.05,5.56 100.96,7.47 140.97,7.47 147.31,13.82 J1.2 147.31,17.63 | 147.31,17.63 J1.3 | P1.A28 P1.A29 P1.A30 P1.A31 P1.A32 P1.C32 10.79,90.65 17.77,97.64 44.45,97.64 67.3,97.64 85.72,97.64 95.24,97.64 99.05,93.83 100.32,91.92 140.97,91.92 C8.2 146.04,95.73 148.59,95.73 157.47,95.73 157.47,83.03 157.47,79.22 157.47,65.89 157.47,59.54 157.47,29.69 145.41,29.69 144.78,29.06 144.52,28.3 143.5,25.25 143.5,21.44 143.5,20.8 144.14,20.8 147.31,17.63
  pour Bottom (isolate 0.61): 12.7,91.29 12.7,91.92 18.41,97.64 44.45,97.64 44.45,94.46 21.58,94.46 22.22,93.83 22.22,89.38 67.94,89.38 67.94,97 78.73,97 78.73,68.43 48.89,68.43 48.89,72.87 46.35,72.87 44.45,74.14 44.45,79.22 66.03,79.22 67.3,80.49 67.3,84.3 66.03,85.57 22.22,85.57 22.22,81.13 43.81,81.13 43.81,73.51 39.37,73.51 39.37,71.6 17.77,71.6 12.7,76.68 12.7,91.92
  pour Bottom (isolate 0.61): 105.41,7.47 105.41,69.7 112.39,76.68 125.09,76.68 128.9,80.49 135.88,80.49 136.52,79.86 136.52,8.1 135.88,7.47
  pour Bottom (isolate 0.61): 12.7,10.64 12.7,39.85 15.24,39.85 15.24,34.77 16.5,33.5 25.39,33.5 27.93,36.04 33.02,36.04 34.29,34.77 34.29,30.33 29.2,28.42 29.2,3.02 20.31,3.02
  pour Bottom (isolate 0.61): 29.84,3.02 29.84,18.26 44.45,32.87 49.53,32.87 49.53,24.61 54.61,19.53 63.5,19.53 66.67,16.36 76.83,16.36 80,19.53 83.81,19.53 83.81,12.55 78.73,12.55 78.73,3.66 78.1,3.02
  pour Bottom (isolate 0.61): 86.99,97 86.99,88.75 88.26,87.48 140.33,87.48 140.33,92.56 100.96,92.56 95.88,97.64
  pour Bottom (isolate 0.61): 102.86,9.37 102.86,39.22 102.23,39.85 96.52,39.85 96.52,36.68 90.8,30.96 90.8,13.82 85.08,13.82 87.62,12.55 91.44,12.55 93.34,10.64 93.34,3.66 92.7,3.02 96.52,3.02 97.15,3.66 97.15,4.29 100.96,8.1
  pour Bottom (isolate 0.61): 86.35,65.89 86.35,48.74 90.8,48.74 100.32,58.27 100.32,61.44 101.59,62.71 101.59,68.43 97.15,68.43 96.52,70.33 86.35,70.33 86.35,66.52 86.99,65.25
  pour Bottom (isolate 0.61): 86.35,70.97 79.37,70.97 78.1,69.7 78.1,69.06 75.56,66.52 74.92,69.7 67.3,69.7 67.3,65.25 67.94,64.62 69.21,64.62 70.48,63.35 70.48,59.54 71.11,59.54 80,50.65 87.62,50.65 87.62,70.33
  pour Bottom (isolate 0.61): 42.54,38.58 42.54,39.22 41.91,39.85 41.91,47.47 43.81,47.47 46.35,44.93 56.51,44.93 64.13,52.55 64.13,51.92 66.03,50.01 66.03,37.95 42.54,37.95
  pour Bottom (isolate 0.61): 46.98,46.2 43.18,50.01 41.91,50.01 41.91,56.36 46.35,60.81 50.16,60.81 51.43,62.08 61.59,62.08 61.59,60.17 60.32,58.9 60.32,53.19 62.23,51.28 55.88,44.93 48.89,44.93 48.26,46.2 46.98,46.2
  pour Bottom (isolate 0.61): 156.84,29.69 142.87,29.69 135.88,34.77 135.88,52.55 157.47,53.19
  pour Bottom (isolate 0.61): 136.52,26.52 136.52,6.83 139.69,6.83 140.33,7.47 141.6,6.83 147.31,12.55 147.31,18.9 146.04,18.9 143.5,21.44 143.5,27.15 144.14,27.79
  pour Bottom (isolate 0.61): 157.47,55.73 146.04,55.73 144.78,54.46 136.52,54.46 136.52,85.57 140.97,85.57 142.87,87.48 142.87,93.83 144.14,93.83 145.41,95.1 157.47,95.1
MA0
  Top 0.406: RN1.2 RN3.2 143.5,74.78 139.06,79.22 P5.4 P4.4 P3.4 P2.4 102.23,79.22 89.53,66.52
  Top 0.61: RN3.2 147.95,74.78 | RN6.16 89.53,66.52
MA1
  Top 0.406: RN1.3 RN3.3 143.5,72.24 139.06,76.68 P5.5 P4.5 P3.5 P2.5 101.59,76.68 92.07,67.16 92.07,65.89 90.16,63.98 RN6.15
MA2
  Top 0.406: RN1.4 RN3.4 139.69,69.7 138.42,71.6 P5.7 P4.7 P3.7 P2.7 98.42,71.6 93.34,66.52 93.34,63.35 91.44,61.44 RN6.14
  Top 0.61: P3.7 113.02,71.6
MA3
  Top 0.406: RN1.5 RN3.5 142.87,67.16 141.6,68.43 138.42,68.43 137.79,69.06 P5.8 P4.8 P3.8 P2.8 97.78,69.06 95.24,66.52 95.24,62.71 91.44,58.9 RN6.13
  Top 0.61: P3.8 113.02,69.06
MA4
  Top 0.406: RN1.6 RN3.6 143.5,64.62 142.87,63.98 139.06,63.98 136.52,61.44 P5.11 P4.11 P3.11 P2.11 102.23,61.44 97.15,56.36 RN6.12
MA5
  Top 0.406: RN3.7 RN1.7 | 147.31,62.08 143.5,58.27 137.79,58.27 137.16,58.9 P5.12 P4.12 P3.12 P2.12 102.23,58.9 97.15,53.82 RN6.11
  Top 0.61: 147.31,62.08 RN3.7
MA6
  Top 0.406: RN2.2 RN4.2 146.04,55.09 144.78,53.82 P5.14 P4.14 P3.14 P2.14 99.69,53.82 97.15,51.28 RN6.10
MA7
  Top 0.406: RN2.3 RN4.3 146.04,52.55 144.78,51.28 P5.15 P4.15 P3.15 P2.15 100.32,51.28 97.78,48.74 RN6.9
  Top 0.61: P5.15 132.07,51.28
MA8
  Top 0.406: P2.17 P3.17 P4.17 P5.17 135.25,46.2 137.79,48.74 145.41,48.74 146.68,50.01 RN4.4 RN2.4
  Bottom 0.406: R9.2 P2.17
MA9
  Top 0.406: RN4.5 RN2.5 | 139.06,47.47 135.25,43.66 P5.18 P4.18 P3.18 P2.18
  Top 0.61: 139.06,47.47 RN4.5
  Bottom 0.406: R10.2 P2.18
MA10
  Top 0.406: RN4.6 RN2.6 | 139.06,44.93 135.25,41.12 P5.19 P4.19 P3.19 P2.19 | P5.24 P4.24 P3.24 P2.24
  Top 0.61: 139.06,44.93 RN4.6
  Bottom 0.406: P2.19 R11.2 97.15,36.04 94.61,33.5 94.61,31.6 95.24,30.96 99.05,30.96 101.59,28.42 P2.24
MD0
  Top 0.406: P5.3 P4.3 P3.3 P2.3 101.59,81.76 86.35,66.52 86.35,40.49 86.99,39.85 IC10.9
MD1  (via drill 0.7)
  Top 0.406: P5.6 P4.6 P3.6 P2.6 | v92.07,74.78 92.07,74.14 85.08,67.16 85.08,39.22 86.99,37.31 IC10.8
  Bottom 0.406: P2.6 96.52,74.14 95.88,74.78 v92.07,74.78
MD2
  Top 0.406: P5.10 P4.10 P3.10 P2.10
  Top 0.61: P4.10 122.55,63.98
  Bottom 0.406: 103.5,63.98 100.32,60.81 100.32,57 93.97,52.55 93.97,37.95 92.07,35.41 91.44,34.77 IC10.7
  Bottom 0.61: 103.5,63.98 P2.10
MD3
  Top 0.406: P5.13 P4.13 P3.13 P2.13
  Bottom 0.406: P2.13 102.86,56.36 95.24,51.28 95.24,36.04 91.44,32.23 IC10.6
MD4
  Top 0.406: P5.16 P4.16 P3.16 P2.16 | 103.5,48.74 100.32,45.57 100.32,38.58 99.05,37.31 99.05,31.6 97.15,29.69 IC10.5
  Top 0.61: 103.5,48.74 P2.16
MD5
  Top 0.406: P5.20 P4.20 P3.20 P2.20 | 102.86,38.58 100.32,36.04 100.32,29.69 99.05,28.42 99.05,26.52 90.16,26.52 IC10.4
  Top 0.61: 102.86,38.58 P2.20
MD6
  Top 0.406: P5.23 P4.23 P3.23 P2.23 | 103.5,30.96 100.32,27.79 100.32,25.88 99.05,24.61 IC10.3
  Top 0.61: 103.5,30.96 P2.23
MD7
  Top 0.406: P5.25 P4.25 P3.25 P2.25 102.86,25.88 98.42,22.07 IC10.2
MR/-W  (via drill 0.7)
  Top 0.406: P2.21 P3.21 P4.21 P5.21 132.71,36.04 139.06,42.39 RN4.7 RN2.7 | R20.2 90.8,45.57 91.44,44.93 98.42,44.93 99.05,44.3 v99.05,39.22
  Top 0.61: P3.21 113.02,36.04
  Bottom 0.406: v99.05,39.22 102.23,36.04 P2.21
N$1
  Top 0.406: RN5.5 76.19,81.13 61.59,66.52 IC1.79
N$2
  Bottom 0.305: R20.1 81.27,45.57 IC1.70
N$3
  Bottom 0.254: IC1.40 50.16,36.04 50.16,29.69 52.07,27.79 52.07,22.71 53.97,20.8 62.86,20.8 64.13,19.53 67.3,19.53 67.94,18.9 JP1.2
N$4
  Bottom 0.254: IC1.41 51.43,30.96 54.61,27.79 54.61,23.98 56.51,22.07 63.5,22.07 64.77,20.8 70.48,20.8 JP3.2
N$5
  Top 0.305: IC11.3 21.58,53.82 22.86,52.55 26.66,52.55 30.47,48.74 30.47,48.11 31.74,46.84 31.74,42.39 30.47,41.12 JP2.2
N$6
  Top 0.406: RN6.8 81.27,48.11 71.75,38.58 67.94,38.58 IC1.55
N$7
  Top 0.406: RN6.7 80.64,51.28 79.37,50.01 79.37,48.11 71.11,39.85 IC1.56
N$8
  Top 0.406: RN6.6 80,53.82 78.1,51.92 78.1,48.74 70.48,41.12 67.94,41.12 IC1.57
N$9
  Top 0.406: RN6.5 80.64,56.36 76.83,52.55 76.83,50.65 IC1.58
N$10
  Top 0.406: RN6.4 79.37,58.9 75.56,55.09 75.56,51.92 70.48,46.2 67.94,46.2 IC1.61
N$11
  Top 0.406: RN6.3 79.37,61.44 74.29,56.36 74.29,53.19 IC1.62
N$12
  Top 0.406: RN6.2 80,63.98 73.02,57 73.02,54.46 70.48,51.28 67.94,51.28 IC1.65
N$13
  Top 0.406: RN6.1 80,66.52 71.75,58.27 71.75,55.73 IC1.66
N$14  (via drill 0.7)
  Top 0.254: v80,44.3 79.37,44.3 72.38,37.31 IC1.54
  Bottom 0.254: R9.1 89.53,46.2 88.89,46.84 86.35,46.84 83.81,44.3 v80,44.3
N$15  (via drill 0.7)
  Top 0.254: v79.37,41.12 77.46,41.12 71.11,34.77 IC1.53
  Bottom 0.254: R10.1 85.72,43.66 83.18,41.12 v79.37,41.12
N$16  (via drill 0.7)
  Top 0.254: v79.37,38.58 76.19,38.58 71.11,33.5 v69.21,33.5
  Bottom 0.254: R11.1 85.72,41.12 83.18,38.58 v79.37,38.58 | v69.21,33.5 69.21,34.14 67.3,36.04 65.4,36.04 IC1.52
N$17
  Top 0.254: RN7.8 64.13,15.09 66.67,15.09 67.94,13.82 LED1.K
N$18
  Top 0.406: RN5.6 74.92,78.59 62.86,66.52 62.86,63.98 IC1.80
N$19
  Top 0.406: RN5.7 73.66,76.05 66.67,69.06 IC1.75
N$20
  Top 0.406: IC1.72 71.75,62.71 74.29,62.71 81.27,69.7 RN5.8
N$21
  Top 0.406: RN5.4 77.46,83.67 60.32,66.52 60.32,63.98 IC1.82
N$22
  Top 0.406: RN5.3 78.73,86.21 59.05,66.52 IC1.81
N$23
  Top 0.406: RN5.2 80,88.75 57.78,66.52 57.78,63.98 IC1.84
N$24
  Top 0.406: IC1.83 56.51,66.52 RN5.1
N$25
  Bottom 0.254: IC1.43 53.97,30.96 57.15,27.79 57.15,23.98 57.78,23.34 63.5,23.34 64.77,22.07 65.4,22.07 66.67,23.34 73.66,23.34 73.66,21.44 JP4.2
N$26  (via drill 0.7)
  Top 0.254: IC1.10 43.18,62.71 41.91,63.98 40.64,63.98 36.19,68.43 v36.19,69.06 | v28.57,69.06 IC2.2
  Bottom 0.254: v28.57,69.06 v36.19,69.06
N$27  (via drill 0.7)
  Top 0.254: v45.72,72.87 42.54,72.87 33.65,81.76 IC2.4
  Bottom 0.254: IC1.7 46.35,69.06 45.72,69.7 v45.72,72.87
N$28
  Top 0.254: RN7.7 58.41,17.63 60.96,15.09 62.23,15.09 63.5,13.82 LED2.K
N$29  (via drill 0.7)
  Top 0.254: R21.1 v46.98,71.6
  Top 0.406: IC1.12 34.92,66.52 34.92,70.97 35.55,71.6 R21.1
  Bottom 0.254: R21.1 41.91,68.43 43.81,66.52 IC1.9 | IC1.74 IC1.76 IC1.77 64.13,67.16 48.89,67.16 46.98,69.06 v46.98,71.6
N$30
  Top 0.254: RN7.6 55.88,17.63 59.05,14.45 LED3.K
N$31
  Top 0.254: RN7.5 53.34,16.36 54.61,15.09 LED4.K
N$32
  Top 0.254: RN7.4 50.8,15.72 50.16,15.09 LED5.K
N$33
  Top 0.254: RN7.3 48.26,17.63 45.72,15.09 LED6.K
N$34
  Top 0.254: RN7.2 41.27,13.82 LED7.K
N$35
  Top 0.254: RN7.1 40,15.09 38.1,15.09 36.83,13.82 LED8.K
N$36
  Top 0.254: RN7.10 55.88,28.42 50.16,28.42 46.35,32.23 IC1.37
N$37
  Bottom 0.406: P2.29 P3.29 P4.29 P5.29 136.52,15.72 R1.1 135.25,18.26 P5.28 | P5.28 P4.28 | P5.28 P3.28 P2.28
N$38
  Top 0.254: RN7.11 53.97,27.79 52.7,27.79 52.07,27.15 52.07,24.61 50.8,23.34 41.91,23.34 39.37,25.88 39.37,36.04 40,36.68 40,38.58 IC1.31
N$39
  Top 0.254: RN7.12 53.34,23.98 51.43,22.07 41.91,22.07 38.73,25.25 IC1.32
N$40
  Top 0.254: RN7.9 60.96,27.15 60.32,27.79 57.78,27.79 56.51,29.06 52.07,29.06 48.89,32.23 IC1.39
N$41
  Top 0.254: RN7.14 48.26,25.25 46.98,23.98 42.54,23.98 41.27,25.25 41.27,30.33 40,31.6 40,35.41 41.27,36.68 IC1.34
N$42
  Top 0.254: RN7.15 45.72,29.06 43.81,30.96 IC1.35
N$43
  Top 0.254: RN7.16 43.18,29.69 41.27,31.6 IC1.33
N$45
  Top 0.254: RN7.13 45.08,31.6 45.08,36.04 IC1.36
R/WDATA  (via drill 0.7)
  Top 0.305: v83.81,50.01 83.81,48.11 81.91,46.2 81.91,44.3 83.81,42.39 83.81,37.95 86.35,35.41 86.35,20.8 87.62,19.53 IC10.1
  Bottom 0.305: IC1.71 67.94,58.9 70.48,58.9 79.37,50.01 v83.81,50.01
TCK
  Top 0.254: IC1.30 37.46,39.85 27.3,29.69 SV1.3
TDI
  Top 0.254: IC1.28 22.22,25.88 SV1.5
TDO  (via drill 0.7)
  Top 0.254: v65.4,23.34 54.61,23.34 52.07,20.8 40,20.8 v38.1,22.71
  Bottom 0.254: IC1.59 67.94,41.12 67.94,36.68 70.48,34.14 70.48,25.88 67.94,25.88 v65.4,23.34 | SV1.4 24.76,21.44 26.03,22.71 v38.1,22.71
TMS
  Top 0.254: IC1.29 40,43.66 37.46,43.66 36.19,41.12 19.68,24.61 SV1.6
VCC  (via drill 0.7)
  Top 0.254: LED8.A 34.29,10.01 38.73,10.01 | 38.73,10.01 43.18,10.01 | 43.18,10.01 47.62,10.01 | 47.62,10.01 52.07,10.01 | 56.51,10.01 52.07,10.01 | 60.96,10.01 56.51,10.01 | 65.4,10.01 60.96,10.01 | 65.4,10.01 LED1.A | 38.73,10.01 LED7.A | 43.18,10.01 LED6.A | 47.62,10.01 LED5.A | 52.07,10.01 LED4.A | 56.51,10.01 LED3.A | 60.96,10.01 LED2.A | 65.4,10.01 63.5,8.1 R31.1
  Top 0.305: 22.86,50.01 27.3,50.01 v28.57,48.74 | IC11.20 24.76,62.08 C9.1 | 21.58,91.29 IC2.14
  Top 0.406: IC11.12 JP2.3 30.47,38.58 33.02,41.12 33.02,46.84 v31.74,48.74 26.66,53.82 26.03,53.82 | IC11.5 21.58,48.74 22.86,50.01 | 26.03,53.82 27.3,55.09 27.3,57 25.39,58.9 IC11.20 23.49,57.63 8.25,57.63 | 26.03,53.82 IC11.18 | 21.58,97.64 21.58,91.29 C22.1 | 47.62,97.64 IC3.16 | IC1.73 67.94,61.44 67.94,63.35 | v99.05,70.33 v137.79,70.33 | IC1.64 67.94,48.74 64.77,48.74 v62.23,51.28 | v46.98,44.93 46.35,44.3 IC1.38 | IC1.78 65.4,63.98 67.94,63.98
  Top 0.61: RN8.1 78.1,6.2 75.56,8.74 | 75.56,8.74 65.4,8.74 64.77,8.1 R31.1 | 81.27,15.09 80.64,15.09 75.56,10.01 75.56,8.74 | 81.27,15.09 C10.1 | 81.27,15.09 IC10.20 | IC1.78 IC1.73 | RN11.1 154.3,91.92 155.57,90.65 155.57,79.22 RN1.1 | C20.+ 34.92,26.52 C12.1
  Top 0.813: C11.1 71.75,67.79 67.94,63.98 67.94,63.35 | v63.5,75.41 69.21,81.13 R30.1 | v74.29,34.77 v76.83,37.31 | 31.74,3.02 31.74,9.37 LED8.A 32.38,13.82 SV1.1 32.38,21.44 C12.1 | 17.14,5.56 17.46,5.88 19.68,8.1 C19.+
  Top 1.778: P1.C2 P1.C3 | P1.C2 12.7,13.18 16.5,9.37 16.5,6.83 17.46,5.88 20.31,3.02 31.74,3.02 60.32,3.02 60.96,4.29 R31.1 | P1.C2 8.25,15.72 8.25,57.63 8.25,90.02 15.87,97.64 21.58,97.64 47.62,97.64 69.21,97.64 R30.1
  Bottom 0.254: JP1.1 JP3.1 JP4.1 76.83,16.99 79.69,19.85 80,20.17
  Bottom 0.305: v31.74,48.74 v28.57,48.74 | 33.65,50.01 C14.1
  Bottom 0.406: 33.65,50.01 IC1.22 40,48.74 43.18,48.74 v46.98,44.93 55.88,44.93 v62.23,51.28 60.32,53.19 60.32,58.9 IC1.78 | 45.08,32.23 45.08,36.04 IC1.38
  Bottom 0.61: v99.05,70.33 97.78,70.33 96.52,71.6 78.73,71.6 78.1,70.97 73.66,70.97 | RN1.1 151.12,74.78 151.12,74.14 150.49,73.51 140.97,73.51 v137.79,70.33 137.79,57 140.33,53.82 149.85,53.82 151.12,55.09 151.12,55.73 153.03,57.63 RN2.1
  Bottom 0.813: v63.5,75.41 66.03,72.87 C21.+ 73.66,70.97 C11.1 | IC1.64 70.48,50.01 75.56,44.93 75.56,38.58 v76.83,37.31 | IC10.20 80,19.53 79.69,19.85 78.1,21.44 78.1,30.96 75.56,33.5 C13.1 74.29,34.14 v74.29,34.77 | C12.1 41.27,30.33 43.18,30.33 45.08,32.23
VCC_RAM  (via drill 0.7)
  Top 0.406: 92.7,3.02 93.34,3.66 | C15.+ 141.85,59.79 145.41,63.35 157.47,63.35
  Top 0.61: 157.47,70.97 C7.1 | P2.1 C4.1 | C17.+ 144.39,28.04 144.78,28.42 | C6.1 141.6,38.58 142.87,39.85 157.47,39.85 | C18.+ 140.97,12.55 140.33,13.18 139.69,13.18 | 139.69,13.18 139.06,13.18 | 139.69,13.18 140.97,13.18
  Top 0.813: 99.69,13.18 C1.1 | 99.69,13.18 P2.30 P3.30 P4.30 P5.30 139.06,13.18 | C18.+ 140.58,12.93 | 99.69,13.18 99.69,6.83 | P2.1 P3.1 P4.1 P5.1 140.33,86.84 C8.1 141.22,87.73 C16.+ | 83.81,97.64 v83.81,68.43 | C4.1 94.61,89.38 94.61,97.64
  Top 1.778: R31.2 75.56,3.02 92.7,3.02 96.52,3.02 100.96,7.47 137.79,7.47 137.79,11.28 139.69,13.18 | 140.97,13.18 C5.1 140.97,18.26 145.41,23.34 J1.4 146.68,23.34 144.78,25.25 144.78,28.42 146.04,29.69 157.47,29.69 157.47,39.85 157.47,63.35 157.47,70.97 157.47,95.73 146.04,95.73 143.5,90.02 C8.1 140.97,88.11 136.52,91.92 100.32,91.92 95.24,97.64 94.61,97.64 83.81,97.64 80.64,97.64 80.64,95.73 R30.2
  Bottom 0.406: C17.+ 139.69,27.79 138.42,26.52 R1.2
  Bottom 0.61: C15.+ 140.33,59.54 | C2.1 97.15,13.82 C1.1
  Bottom 0.813: C3.1 95.24,63.35 95.24,64.62 91.44,68.43 v83.81,68.43
  pour Top: 99.69,13.18 138.42,13.18 138.42,7.47 99.69,7.47
  pour Top: 100.32,91.92 100.96,91.92 100.96,86.84 140.97,86.84 140.97,88.75 139.69,88.75 136.52,91.92

### Text on the board
Top: 1 | CSA_RAMDISK-V2.0F | (C) A. Fachat
tPlace: 1 | CSA_RAMDISK-V2.0F | (C) A. Fachat